# EAGLE design 0x03_quantizer (EAGLE 7.1.0)
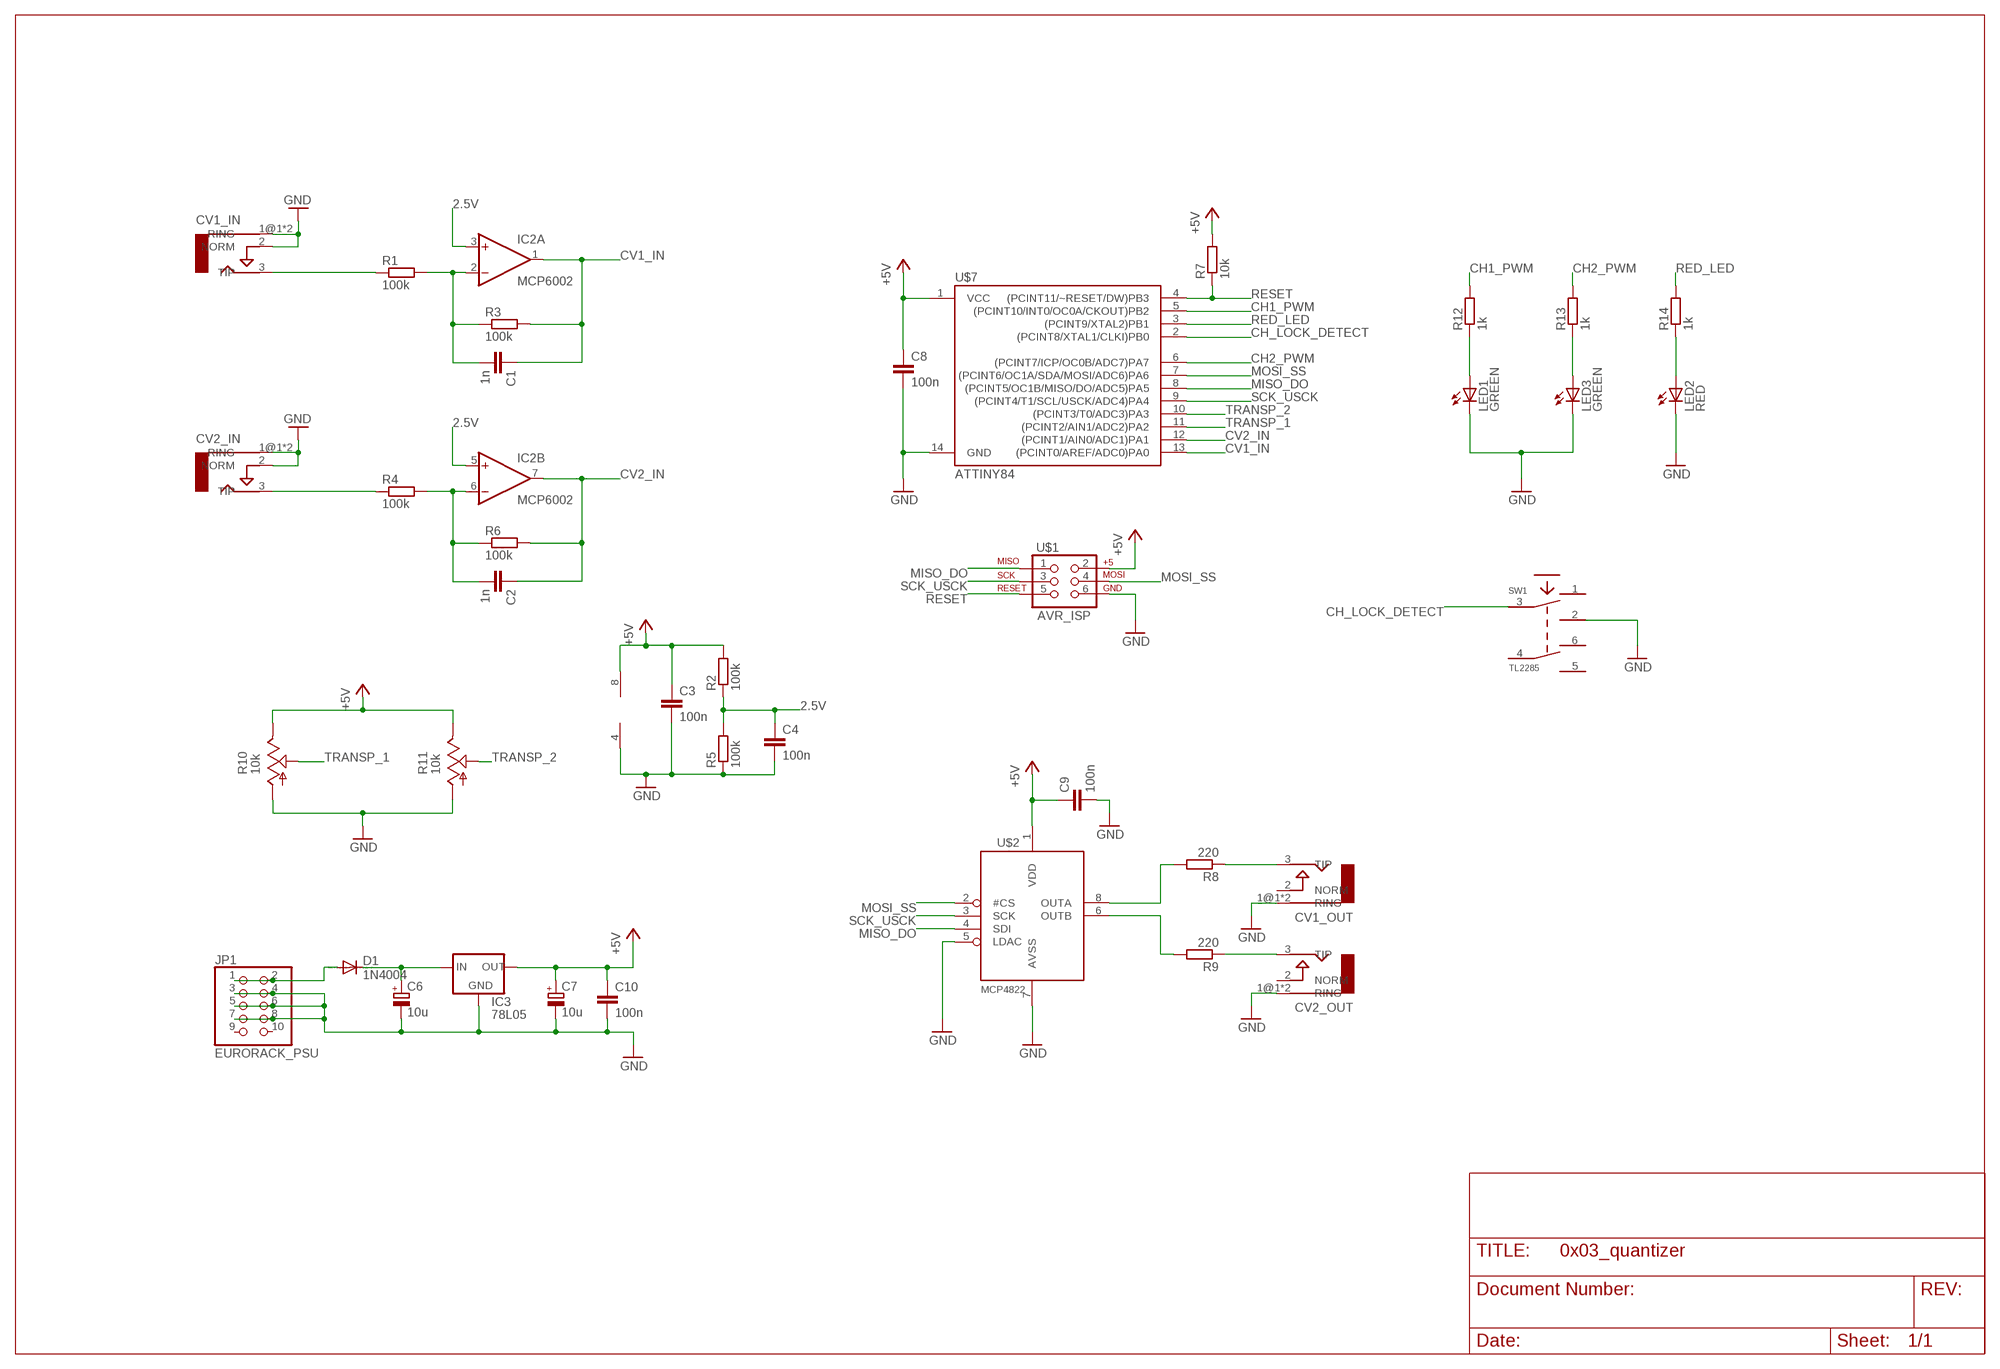
[diagram p0: schematic, sheet 1]

## Parts
C1  1n  C-EU025-025X050  [C025-025X050]
C2  1n  C-EU025-025X050  [C025-025X050]
C3  100n  C-EU025-025X050  [C025-025X050]
C4  100n  C-EU025-025X050  [C025-025X050]
C6  10u  CPOL-EUE2.5-5  [E2,5-5]
C7  10u  CPOL-EUE2.5-5  [E2,5-5]
C8  100n  C-EU025-025X050  [C025-025X050]
C9  100n  C-EU025-025X050  [C025-025X050]
C10  100n  C-EU025-025X050  [C025-025X050]
CV1_IN  CV1_IN  AUDIO-JACKERTHENVAR  [ERTHENVAR-JACK]
CV1_OUT  AUDIO-JACKERTHENVAR  [ERTHENVAR-JACK]
CV2_IN  CV2_IN  AUDIO-JACKERTHENVAR  [ERTHENVAR-JACK]
CV2_OUT  AUDIO-JACKERTHENVAR  [ERTHENVAR-JACK]
D1  1N4004  [DO41-10]
IC2  MCP6002  TL072P  [DIL08]
IC3  78L05  78LXX  [78LXX]
JP1  EURORACK_PSU  PINHD-2X5  [2X05]
LED1  GREEN  LED5MM  [LED5MM]
LED2  RED  LED5MM  [LED5MM]
LED3  GREEN  LED5MM  [LED5MM]
R1  100k  R-EU_0207/2V  [0207/2V]
R2  100k  R-EU_0207/2V  [0207/2V]
R3  100k  R-EU_0207/2V  [0207/2V]
R4  100k  R-EU_0207/2V  [0207/2V]
R5  100k  R-EU_0207/2V  [0207/2V]
R6  100k  R-EU_0207/2V  [0207/2V]
R7  10k  R-EU_0207/2V  [0207/2V]
R8  220  R-EU_0207/2V  [0207/2V]
R9  220  R-EU_0207/2V  [0207/2V]
R10  10k  POT_USVERTICAL  [ALPS_POT_VERTICAL]
R11  10k  POT_USVERTICAL  [ALPS_POT_VERTICAL]
R12  1k  R-EU_0207/2V  [0207/2V]
R13  1k  R-EU_0207/2V  [0207/2V]
R14  1k  R-EU_0207/2V  [0207/2V]
SW1  TL2285  [TL2285_PCB]
U$1  AVR_ISP  AVR_SPI_PRG_6PTH  [2X3]
U$2  MCP4822  [DIL08]
U$7  ATTINY84  ATTINY84ATTINY84-20PU  [DIL14]

## Nets
2.5V: C4.1 IC2.3(A:+IN) IC2.5(B:+IN) R2.1 R5.2
12V: D1.A JP1.1 JP1.2
+5V: C3.1 C7.+ C8.1 C9.1 C10.1 IC2.8(P:V+) IC3.OUT R2.2 R7.2 R10.P$1(E) R11.P$1(E) U$1.2 U$2.1(VDD) U$7.1(VCC)
AVSS: U$2.7(AVSS) ; supply symbol labelled GND
CH1_PWM: R12.2 U$7.5((PCINT10/INT0/OC0A/CKOUT)PB2)
CH2_PWM: R13.2 U$7.6((PCINT7/ICP/OC0B/ADC7)PA7)
CH_LOCK_DETECT: SW1.3 U$7.2((PCINT8/XTAL1/CLKI)PB0)
CV1_IN: C1.1 IC2.1(A:OUT) R3.2 U$7.13((PCINT0/AREF/ADC0)PA0)
CV2_IN: C2.1 IC2.7(B:OUT) R6.2 U$7.12((PCINT1/AIN0/ADC1)PA1)
GND: C3.2 C4.2 C6.- C7.- C8.2 C9.2 C10.2 CV1_IN.1@1(RING) CV1_IN.1@2(RING) CV1_IN.2(NORM) CV1_OUT.1@1(RING) CV1_OUT.1@2(RING) CV2_IN.1@1(RING) CV2_IN.1@2(RING) CV2_IN.2(NORM) CV2_OUT.1@1(RING) CV2_OUT.1@2(RING) IC2.4(P:V-) IC3.GND JP1.3 JP1.4 JP1.5 JP1.6 JP1.7 JP1.8 LED1.K(C) LED2.K(C) LED3.K(C) R5.1 R10.P$3(A) R11.P$3(A) SW1.2 U$1.6 U$2.5(LDAC) U$7.14(GND)
MISO_DO: U$1.1 U$2.4(SDI) U$7.8((PCINT5/OC1B/MISO/DO/ADC5)PA5)
MOSI_SS: U$1.4 U$2.2(#CS) U$7.7((PCINT6/OC1A/SDA/MOSI/ADC6)PA6)
N$1: C1.2 IC2.2(A:-IN) R1.2 R3.1
N$2: C6.+ D1.C IC3.IN
N$4: CV1_OUT.3(TIP) R8.1
N$5: CV1_IN.3(TIP) R1.1
N$6: CV2_OUT.3(TIP) R9.1
N$7: R9.2 U$2.6(OUTB)
N$8: C2.2 IC2.6(B:-IN) R4.2 R6.1
N$9: LED2.A R14.1
N$10: CV2_IN.3(TIP) R4.1
N$11: R8.2 U$2.8(OUTA)
N$12: LED3.A R13.1
N$13: LED1.A R12.1
RED_LED: R14.2 U$7.3((PCINT9/XTAL2)PB1)
RESET: R7.1 U$1.5 U$7.4((PCINT11/~RESET/DW)PB3)
SCK_USCK: U$1.3 U$2.3(SCK) U$7.9((PCINT4/T1/SCL/USCK/ADC4)PA4)
TRANSP_1: R10.P$2(S) U$7.11((PCINT2/AIN1/ADC2)PA2)
TRANSP_2: R11.P$2(S) U$7.10((PCINT3/T0/ADC3)PA3)
Unconnected: CV1_OUT.2(NORM) CV2_OUT.2(NORM) JP1.9 JP1.10 SW1.1 SW1.4 SW1.5 SW1.6

## Library data of the parts
C1-C4 C8-C10 = rcl:C-EU: CAPACITOR, European symbol
C6 C7 = rcl:CPOL-EU: POLARIZED CAPACITOR, European symbol
CV1_IN CV1_OUT CV2_IN CV2_OUT = erthenvar:AUDIO-JACK: Switching Mono 3.5mm Audio Jack from Erthenvar.
D1 = diode:1N4004: DIODE general purpose rectifier, 1 A
IC2 = og-linear:TL072: OP AMP
IC3 = v-reg:78LXX: VOLTAGE REGULATOR
JP1 = pinhead:PINHD-2X5: PIN HEADER
LED1-LED3 = led:LED: LED OSRAM: - CHIPLED LG R971, LG N971, LY N971, LG Q971, LY Q971, LO R971, LY R971 LH N974, LH R974 LS Q976, LO Q976, LY Q976 LO Q996 - Hyper CHIPLED LW Q18S LB Q993, LB Q99A, LB R99A - SideLED LS A670, LO A670, LY A670, LG A670, LP A670 LB A673, LV A673, LT A673, LW A673 LH A674 LY A675 LS A676, LA A676, LO A676, LY A676, LW A676 LS A679, LY A679, LG A679 - Hyper Micro SIDELED® LS Y876, LA Y876, LO Y876, LY Y876 LT Y87S - SmartLED LW L88C, LW L88S LB L89C, LB L89S, LG L890 LS L89K, LO L89K, LY L89K LS L896, LA L896, LO L896, LY L896 - TOPLED LS T670, LO T670, LY T670, LG T670, LP T670 LSG T670, LSP T670, LSY T670, LOP T670, LYG T670 LG T671, LOG T671, LSG T671 LB T673, LV T673, LT T673, LW T673 LH T674 LS T676, LA T676, LO T676, LY T676, LB T676, LH T676, LSB T676, LW T676 LB T67C, LV T67C, LT T67C, LS T67K, LO T67K, LY T67K, LW E67C LS E67B, LA E67B, LO E67B, LY E67B, LB E67C, LV E67C, LT E67C LW T67C LS T679, LY T679, LG T679 LS T770, LO T770, LY T770, LG T770, LP T770 LB T773, LV T773, LT T773, LW T773 LH T774 LS E675, LA E675, LY E675, LS T675 LS T776, LA T776, LO T776, LY T776, LB T776 LHGB T686 LT T68C, LB T68C - Hyper Mini TOPLED® LB M676 - Mini TOPLED Santana® LG M470 LS M47K, LO M47K, LY M47K Source: http://www.osram.convergy.de LUXEON: - LUMILED® LXK2-PW12-R00, LXK2-PW12-S00, LXK2-PW14-U00, LXK2-PW14-V00 LXK2-PM12-R00, LXK2-PM12-S00, LXK2-PM14-U00 LXK2-PE12-Q00, LXK2-PE12-R00, LXK2-PE12-S00, LXK2-PE14-T00, LXK2-PE14-U00 LXK2-PB12-K00, LXK2-PB12-L00, LXK2-PB12-M00, LXK2-PB14-N00, LXK2-PB14-P00, LXK2-PB14-Q00 LXK2-PR12-L00, LXK2-PR12-M00, LXK2-PR14-Q00, LXK2-PR14-R00 LXK2-PD12-Q00, LXK2-PD12-R00, LXK2-PD12-S00 LXK2-PH12-R00, LXK2-PH12-S00 LXK2-PL12-P00, LXK2-PL12-Q00, LXK2-PL12-R00 Source: www.luxeon.com KINGBRIGHT: KA-3528ASYC Source: www.kingbright.com
R1-R9 R12-R14 = rcl:R-EU_: RESISTOR, European symbol
R10 R11 = pot-alps:POT_US
SW1 = lb_devs:TL2285: E-Switch TL2285 (PCB switch)
U$1 = MI_CVPal_extracted:AVR_SPI_PRG_6: AVR ISP 6 Pin This is the reduced ISP connector for AVR programming. Common on Arduino. This footprint will take up less PCB space and can be used with a 10-pin to 6-pin adapter such as SKU: BOB-08508
U$2 = MI_CVPal_extracted:MCP4822
U$7 = SparkFun-DigitalIC:ATTINY84: Atmel 14-pin 2/4/8kB flash uC

## Board
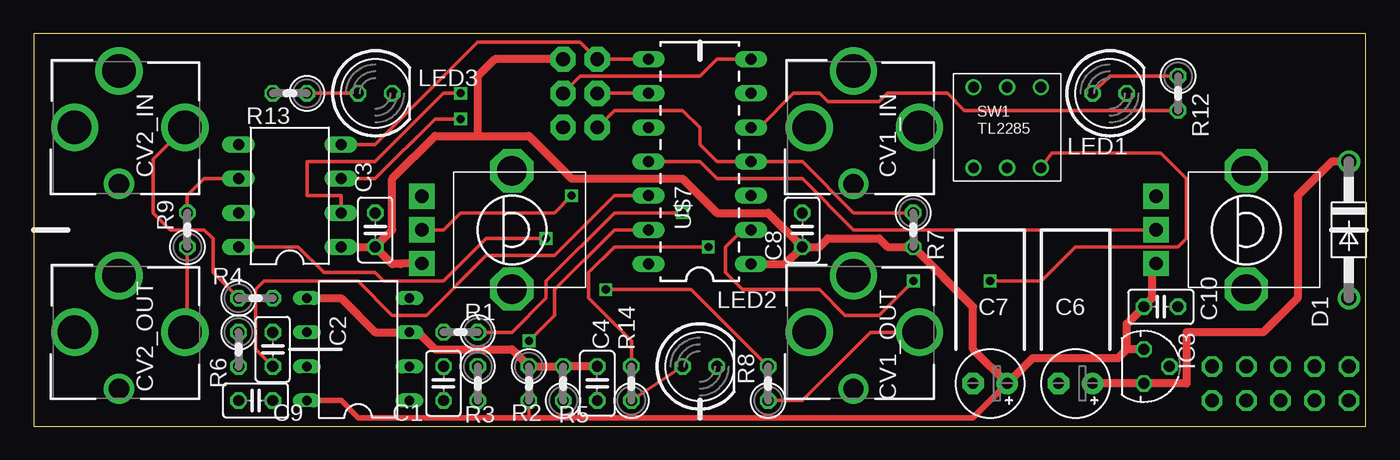
[diagram p1: board, top side]
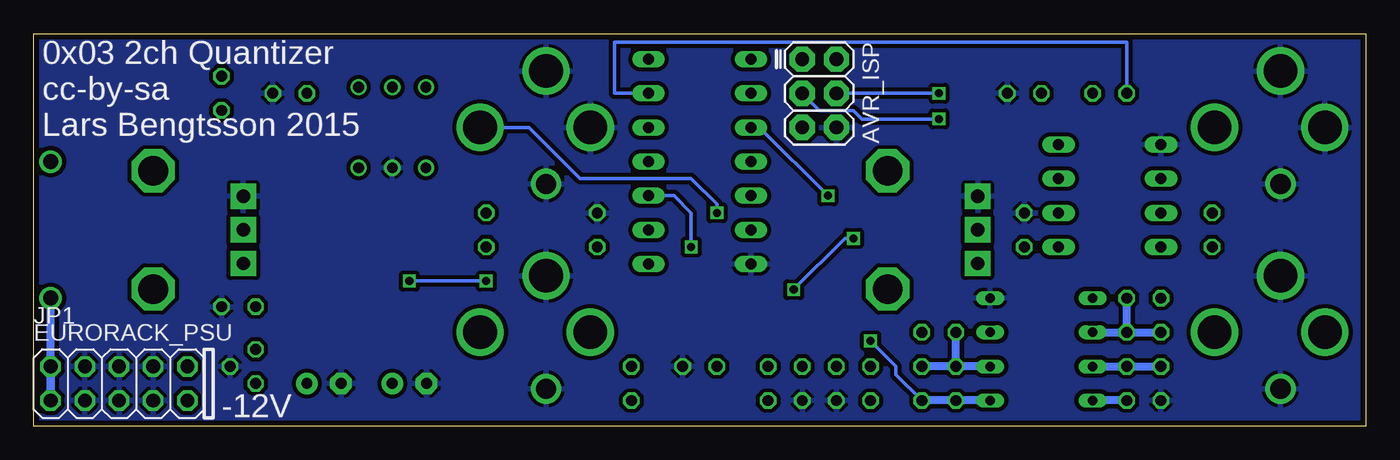
[diagram p2: board, bottom side, seen from below]

Size 99.06 x 29.21 mm. Coordinates in mm from the lower left corner, seen from the top.
Outline: 0,0 99.06,0 99.06,29.21 0,29.21 0,0
Copper layers (1*16): Top 0.0356mm / dielectric 1.5011mm / Bottom 0.0356mm
Design rules "LaenPCBOrder": minimum track width 6mil, minimum drill 13mil, track to track 6mil, track to pad 6mil, pad to pad 6mil, via to via 6mil, smd to smd 6mil, copper to edge 15mil, drill to drill 6mil, minimum pad ring 7mil, minimum via ring 7mil, stop-mask expansion 3mil, vias tented up to drill 0mil, thermal gap 10mil

### Footprints (pad centres in the part's own frame; a part is rotated, then mirrored left to right if it is on the bottom)
C025-025X050 = drill 0.813 octagon: 1 -1.27,0; 2 1.27,0
E2,5-5 = drill 0.813 pad 1.6: + -1.27,0 | drill 0.813 pad 1.6 octagon: - 1.27,0
ERTHENVAR-JACK = drill 2.5: 1@1 -4.2,0; 2 0,-3.3; 3 0,4.9 | drill 1.5: 1@2 4.2,0
DO41-10 = drill 1.118: A 5.08,0; C -5.08,0
DIL08 = drill 0.7 long: 1 -3.81,-3.81; 2 -1.27,-3.81; 3 1.27,-3.81; 4 3.81,-3.81; 5 3.81,3.81; 6 1.27,3.81; 7 -1.27,3.81; 8 -3.81,3.81
78LXX = drill 0.813 octagon: GND 0,1.905; IN 1.27,0; OUT -1.27,0
2X05 = drill 1.016 octagon: 1 -5.08,-1.27; 2 -5.08,1.27; 3 -2.54,-1.27; 4 -2.54,1.27; 5 0,-1.27; 6 0,1.27; 7 2.54,-1.27; 8 2.54,1.27; 9 5.08,-1.27; 10 5.08,1.27
LED5MM = drill 0.813 octagon: A -1.27,0; K 1.27,0
0207/2V = drill 0.813 octagon: 1 -1.27,0; 2 1.27,0
ALPS_POT_VERTICAL = drill 1 pad 1.88 square: P$1 -2.5,6.7; P$2 0,6.7; P$3 2.5,6.7 | drill 2.2 pad 3.175 octagon: P$4 -4.4,0; P$5 4.4,0
TL2285_PCB = drill 0.8: 1 -2.5,-3; 2 0,-3; 3 2.5,-3; 4 -2.5,3; 5 0,3; 6 2.5,3
2X3 = drill 1.016 pad 1.88 octagon: 1 0,0; 2 0,2.54; 3 2.54,0; 4 2.54,2.54; 5 5.08,0; 6 5.08,2.54
DIL08' = drill 0.813 long: 1 -3.81,-3.81; 2 -1.27,-3.81; 3 1.27,-3.81; 4 3.81,-3.81; 5 3.81,3.81; 6 1.27,3.81; 7 -1.27,3.81; 8 -3.81,3.81
DIL14 = drill 0.813 long: 1 -8.89,-3.81; 2 -6.35,-3.81; 3 -3.81,-3.81; 4 -1.27,-3.81; 5 1.27,-3.81; 6 3.81,-3.81; 7 6.35,-3.81; 8 6.35,3.81; 9 3.81,3.81; 10 1.27,3.81; 11 -1.27,3.81; 12 -3.81,3.81; 13 -6.35,3.81; 14 -8.89,3.81

### Placement (x,y rotation side)
C1  30.48,3.17 90 top
C2  17.78,5.71 90 top
C3  25.4,14.61 90 top
C4  41.91,3.17 270 top
C6  77.47,3.17 180 top
C7  71.12,3.17 180 top
C8  57.15,14.61 90 top
C9  16.51,1.91 180 top
C10  83.82,8.89 0 top
CV1_IN  60.96,22.22 270 top
CV1_OUT  60.96,6.99 270 top
CV2_IN  6.35,22.22 270 top
CV2_OUT  6.35,6.99 270 top
D1  97.79,14.61 270 top
IC2  24.13,5.71 90 top
IC3  82.55,4.45 270 top
JP1  92.71,3.17 0 bottom
LED1  80.01,24.76 0 top
LED2  49.53,4.45 0 top
LED3  25.4,24.76 0 top
R1  31.75,6.99 180 top
R2  36.83,3.17 270 top
R3  33.02,3.17 270 top
R4  16.51,9.53 0 top
R5  39.37,3.17 90 top
R6  15.24,5.71 270 top
R7  65.41,14.61 270 top
R8  54.61,3.17 90 top
R9  11.43,14.61 90 top
R10  90.17,14.61 90 top
R11  35.56,14.61 90 top
R12  85.09,24.76 270 top
R13  19.05,24.76 180 top
R14  44.45,3.17 90 top
SW1  72.39,22.22 0 top
U$1  41.91,27.3 270 bottom
U$2  MCP4822  [DIL08']  19.05,17.14 90 top
U$7  49.53,20.95 90 top

### Tracks (layer width: path | path; a pad name or v marks a point on that pad's centre or on a via)
2.5V
  Top 0.61: IC2.5 22.86,9.53 25.4,6.99 IC2.3 28.57,6.99 29.84,5.71 35.56,5.71 R2.1 R5.2 C4.1
12V
  Bottom 0.61: JP1.2 JP1.1 D1.A
+5V
  Top 0.254: R2.2 36.83,0.64
  Top 0.406: IC2.8 22.86,1.91 24.13,0.64 36.83,0.64 69.85,0.64 C7.+
  Top 0.61: IC3.OUT 81.28,5.71 | 81.28,5.71 80.64,5.08 74.3,5.08 C7.+ 69.85,5.71 69.85,8.89 R7.2 63.5,13.34 62.87,13.97 59.05,13.97 58.42,13.34 C8.1 | 81.28,5.71 81.28,7.62 C10.1 83.19,9.53 83.19,11.82 R10.P$1 | U$7.1 55.88,12.06 C8.1 | U$1.2 34.29,27.3 33.02,26.04 33.02,21.59 | 33.02,21.59 36.83,21.59 40.01,18.41 48.26,18.41 50.8,15.88 54.61,15.88 C8.1 | U$2.1 C3.1 | C3.1 26.67,14.61 26.67,18.41 29.84,21.59 33.02,21.59 | R11.P$1 27.34,12.11 27.3,12.06 26.67,12.06 C3.1
  Bottom 0.61: C9.1 IC2.8
CH1_PWM
  Top 0.254: R12.2 69.22,23.49 67.94,24.76 63.5,24.76 62.87,24.13 59.05,24.13 58.42,24.76 56.52,24.76 53.98,22.22 U$7.5
CH2_PWM
  Bottom 0.254: U$7.6 55.88,24.76 55.88,28.57 17.78,28.57 R13.2
CH_LOCK_DETECT  (via drill 0.6)
  Top 0.254: U$7.2 52.7,14.61 51.44,13.34 51.44,11.43 52.7,10.16 58.42,10.16 60.33,8.26 62.87,8.26 v65.41,10.79 | v71.12,10.79 74.93,10.79 77.47,13.34 85.09,13.34 85.72,13.97 85.72,18.41 83.82,20.32 75.7,20.32 SW1.3
  Bottom 0.254: v65.41,10.79 v71.12,10.79
CV1_IN  (via drill 0.6)
  Top 0.254: U$7.13 43.18,14.61 38.73,10.16 38.73,8.26 v36.83,6.35
  Bottom 0.254: v36.83,6.35 34.92,4.45 34.92,3.81 R3.2
  Bottom 0.61: IC2.1 C1.1 R3.2
CV2_IN
  Top 0.254: U$7.12 43.18,17.14 38.73,12.7 33.66,12.7 29.21,8.26 26.67,8.26 24.13,10.79 17.14,10.79 16.51,10.16 16.51,5.71 C2.1
  Bottom 0.61: IC2.7 C2.1 R6.2
GND
  pour Bottom (isolate 0.305): 0,28.57 0,0.64 99.06,0.64 99.06,28.57
MISO_DO
  Top 0.254: U$7.8 U$1.1 40.64,28.57 33.02,28.57 25.4,20.95 U$2.4
MOSI_SS  (via drill 0.6)
  Top 0.254: U$7.7 50.8,27.3 49.53,26.04 40.64,26.04 U$1.4 | v31.75,24.76 30.48,24.76 25.4,19.68 20.32,19.68 20.32,17.14 22.86,17.14 U$2.2
  Bottom 0.254: U$1.4 v31.75,24.76
N$1
  Bottom 0.61: IC2.2 C1.2 | C1.2 R3.1 | C1.2 R1.2
N$2
  Top 0.61: D1.C 96.52,19.68 93.98,17.14 93.98,9.53 91.44,6.99 85.72,6.99 85.72,3.17 IC3.IN C6.+
N$4
  Top 0.254: CV1_OUT.3 62.23,6.99 57.15,1.91 R8.1
N$5  (via drill 0.6)
  Top 0.254: v48.26,15.88 43.18,15.88 38.1,10.79 38.1,9.53 35.56,6.99 R1.1
  Bottom 0.254: CV1_IN.3 62.23,22.22 58.42,18.41 50.16,18.41 48.26,16.51 v48.26,15.88
N$6
  Top 0.254: R9.1 11.43,7.17 CV2_OUT.3
N$7
  Top 0.254: U$2.6 12.7,18.41 11.43,17.14 R9.2
N$8
  Bottom 0.61: IC2.6 C2.2 | C2.2 R6.1 | C2.2 R4.2
N$9
  Top 0.254: R14.1 LED2.A
N$10
  Top 0.254: R4.1 13.34,11.43 13.34,13.97 12.7,14.61 10.16,14.61 8.89,15.88 8.89,19.86 CV2_IN.3
N$11  (via drill 0.6)
  Top 0.254: U$2.8 19.68,13.34 21.59,11.43 25.4,11.43 26.04,10.79 30.48,10.79 33.66,13.97 v38.1,13.97 | v42.55,10.16 48.9,10.16 R8.2
  Bottom 0.254: v38.1,13.97 38.73,13.97 v42.55,10.16
N$12
  Top 0.254: R13.1 LED3.A
N$13
  Top 0.254: R12.1 80.01,26.04 LED1.A
RED_LED  (via drill 0.6)
  Top 0.254: v50.16,13.34 43.18,13.34 41.27,11.43 41.27,9.53 44.45,6.35 R14.2
  Bottom 0.254: U$7.3 51.44,17.14 50.16,15.88 v50.16,13.34
RESET
  Top 0.254: U$1.5 43.18,23.49 48.26,23.49 49.53,22.22 49.53,20.95 50.8,19.68 U$7.4 57.15,19.68 60.96,15.88 R7.1
SCK_USCK  (via drill 0.6)
  Top 0.254: U$1.3 U$7.9 | U$2.3 25.4,18.41 29.84,22.86 v31.75,22.86
  Bottom 0.254: v31.75,22.86 37.47,22.86 38.1,23.49 40.64,23.49 U$1.3
TRANSP_1
  Top 0.254: U$7.11 49.53,19.68 50.8,18.41 57.15,18.41 60.96,14.61 R10.P$2
TRANSP_2  (via drill 0.6)
  Top 0.254: v40.01,17.14 38.73,15.88 31.75,15.88 30.48,14.61 R11.P$2
  Bottom 0.254: U$7.10 45.09,22.22 v40.01,17.14

### Text on the board
bPlace: 0x03 2ch Quantizer / cc-by-sa / Lars Bengtsson 2015 | -12V